# Altium schematic sheet EdgeMax_PowerSupply.SchDoc
size A3; SheetNumber: 2; SheetTotal: 3
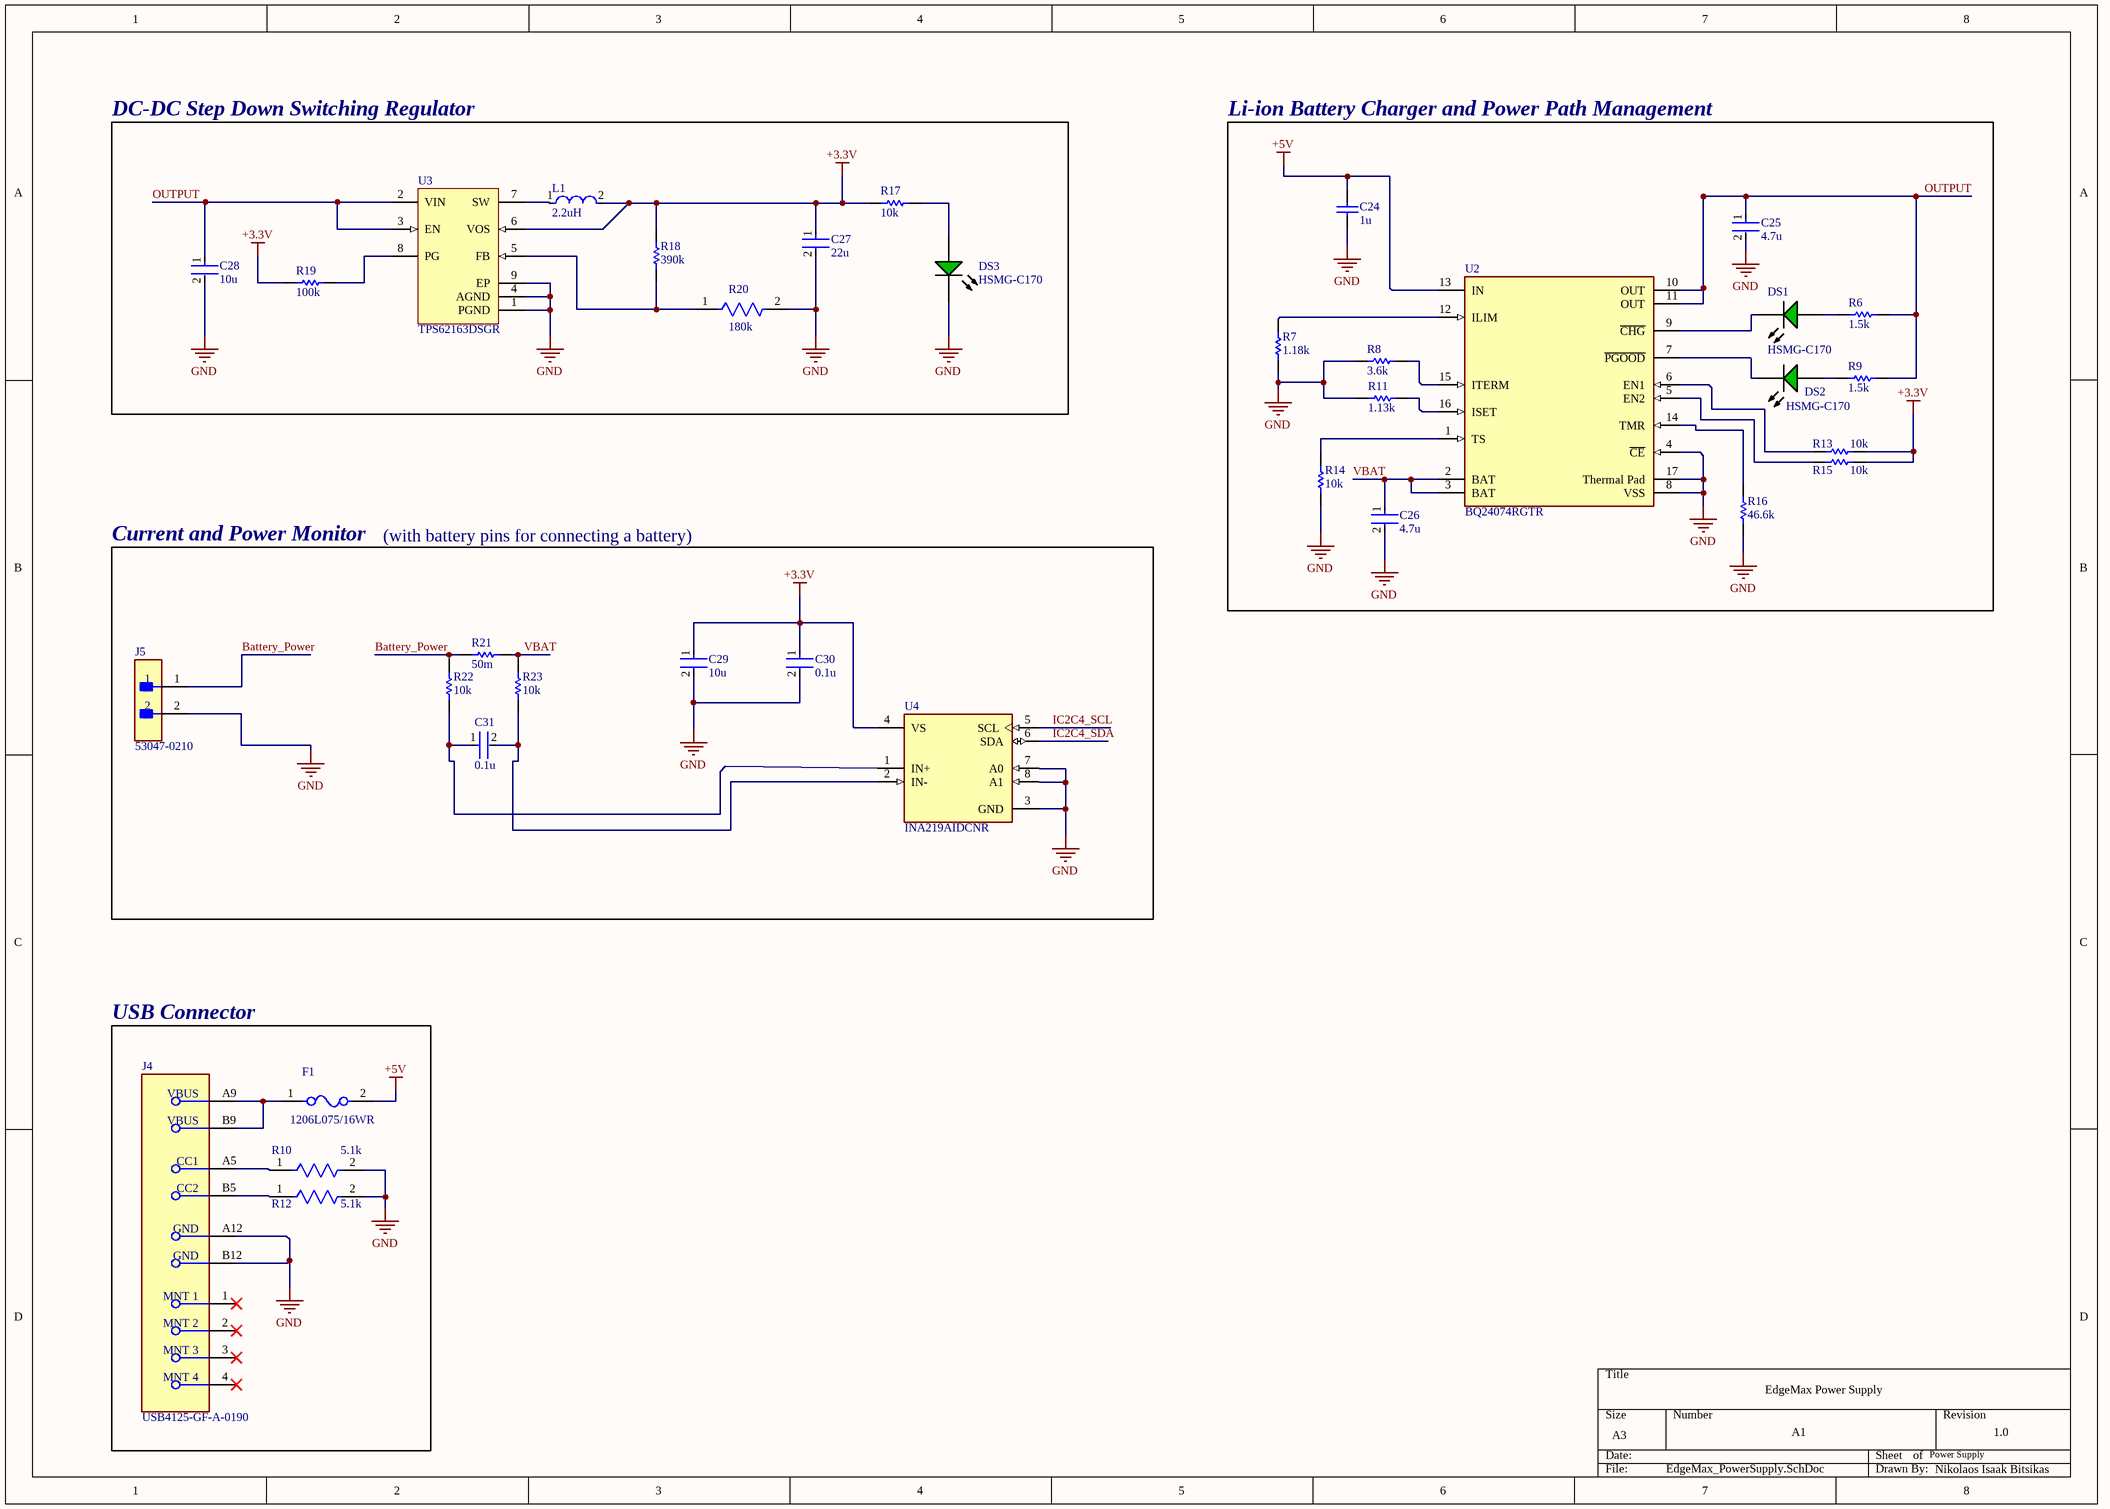
[diagram p0: EdgeMax_PowerSupply.SchDoc]

## Parts
C24  1u  [CAPC1608X90X35LL15T15]
C25  4.7u  [FP-CC1206-1_25-MFG]
C26  4.7u  [FP-CC1206-1_25-MFG]
C27  22u  [FP-C0805C226M9PACTU-MFG]
C28  10u  [FP-C0805C106K9PACTU-MFG]
C29  10u  [FP-GRM21B-0_1-MFG]
C30  0.1u  [FP-C0402-BB-MFG]
C31  0.1u  [FP-C0402-BB-MFG]
DS1  HSMG-C170  [AVAG-HSMX-C170_V]
DS2  HSMG-C170  [AVAG-HSMX-C170_V]
DS3  HSMG-C170  [AVAG-HSMX-C170_V]
F1  1206L075/16WR  [FP-1206L-MFG]
J4  USB4125-GF-A-0190  [FP-USB4125-GF-A-0190-MFG]
J5  53047-0210  [FP-53047-0210-MFG]
L1  2.2uH  [FP-CBMF1608-MFG]
R6  1.5k  [RESC1005X40X25LL10T10]
R7  1.18k  [RESC1609X50X30ML10T20]
R8  3.6k  [RESC1005X40X25ML05T05]
R9  1.5k  [RESC1005X40X25LL10T10]
R10  5.1k  [FP-CRCW0603-e3-IPC_C]
R11  1.13k  [RESC1005X40X25NL05T05]
R12  5.1k  [FP-CRCW0603-e3-IPC_C]
R13  10k  [RESC2013X60X35NL10T20]
R14  10k  [RESC2013X60X35NL10T20]
R15  10k  [RESC2013X60X35NL10T20]
R16  46.6k  [RESC1608X55X30LL15T15]
R17  10k  [RESC2013X60X35NL10T20]
R18  390k  [RESC0603X26X15NL03T05]
R19  100k  [RESC2013X50X30ML20T20]
R20  180k  [FP-CRCW0603-e3-IPC_A]
R21  50m  [RESC3225X70X50NL20T20]
R22  10k  [RESC2013X50X30NL20T20]
R23  10k  [RESC2013X50X30NL20T20]
U2  BQ24074RGTR  [FP-RGT0016C-IPC_B]
U3  TPS62163DSGR  [DSG0008A_V]
U4  INA219AIDCNR  [FP-DCN0008A-IPC_B]

## Blocks framed on the sheet
DC-DC Step Down Switching Regulator: C27 C28 DS3 L1 R17-R20 U3
Li-ion Battery Charger and Power Path Management: C24-C26 DS1 DS2 R6-R9 R11 R13-R16 U2
Current and Power Monitor: C29-C31 J5 R21-R23 U4
USB Connector: F1 J4 R10 R12

## Nets
+3.3V: C27.1 C29.1 C30.1 L1.2 R13.1 R15.1 R17.1 R18.2 R19.1 U3.6(VOS) U4.4(VS)
+5V: C24.2 F1.2 U2.13(IN)
GND: C24.1 C25.2 C26.2 C27.2 C28.2 C29.2 C30.2 DS3.2(K) J4.A12(GND) J4.B12(GND) J5.2 R7.1 R8.2 R10.2 R11.2 R12.2 R14.1 R16.1 R20.2 U2.4(~{CE}) U2.8(VSS) U2.17(Thermal_Pad) U3.1(PGND) U3.4(AGND) U3.9(EP) U4.3(GND) U4.7(A0) U4.8(A1)
Battery_Power: J5.1 R21.1 R22.2
IC2C4_SCL: U4.5(SCL)
IC2C4_SDA: U4.6(SDA)
OUTPUT: C25.1 C28.1 R6.2 R9.2 U2.10(OUT) U2.11(OUT) U3.2(VIN) U3.3(EN)
VBAT: C26.1 R21.2 R23.2 U2.2(BAT) U2.3(BAT)
NetC31_1: C31.1 R22.1 U4.1(IN+)
NetC31_2: C31.2 R23.1 U4.2(IN-)
NetDS1_1: DS1.1(A) R6.1
NetDS1_2: DS1.2(K) U2.9(~{CHG})
NetDS2_1: DS2.1(A) R9.1
NetDS2_2: DS2.2(K) U2.7(~{PGOOD})
NetDS3_1: DS3.1(A) R17.2
NetF1_1: F1.1 J4.A9(VBUS) J4.B9(VBUS)
NetJ4_A5: J4.A5(CC1) R10.1
NetJ4_B5: J4.B5(CC2) R12.1
NetL1_1: L1.1 U3.7(SW)
NetR7_2: R7.2 U2.12(ILIM)
NetR8_1: R8.1 U2.15(ITERM)
NetR11_1: R11.1 U2.16(ISET)
NetR13_2: R13.2 U2.6(EN1)
NetR14_2: R14.2 U2.1(TS)
NetR15_2: R15.2 U2.5(EN2)
NetR16_2: R16.2 U2.14(TMR)
NetR18_1: R18.1 R20.1 U3.5(FB)
NetR19_2: R19.2 U3.8(PG)

Not connected (* = marked no-connect by the designer): J4 1(MNT_1)* 2(MNT_2)* 3(MNT_3)* 4(MNT_4)*

## Notes on the sheet
- (with battery pins for connecting a battery)
- EdgeMax Power Supply
- A1
- Power Supply
- 1.0
- Nikolaos Isaak Bitsikas

## Library data of the parts
C24 = CMP-2006-02298-2: Manufacturer: Kemet; Part Number: C0603C105K4RACTU
C25 C26 = CMP-03422-000173-1: CAP CER 4.7UF 50V X7R 1206; Manufacturer Part Number: CC1206KKX7R9BB475; Manufacturer: Yageo; Automotive Grade: NA; Tolerance: 0.1; Temperature Coefficient: 15%; Material: Ceramic; Device Class L1: Passive Components; Category: Cap; Height: 1.45mm; Temperature Range Low: -55°C; Temperature Range High: +125°C; Package: CC1206-1.25; Lead Free: Yes; Temperature: -55°C to +125°C; RoHS: TRUE; Digikey Description: CAP CER 4.7UF 50V X7R 1206; Voltage Rating: 50 V; Device Class L2: Capacitors; Capacitance: 4.7 uF; Footprint Url: http://www.yageo.com/exep/pages/download/literatures/UPY-C_GEN_24.pdf; ComponentLink2URL: http://www.yageo.com/documents/recent/UPY-NP0X7R_HV_1KV-to-3KV_11.pdf; Temperature Characteristic: X7R; Mouser Description: CC Series 1206 4.7 uF 50 V ±10% Tolerance X7R Multilayer Ceramic Capacitor; ComponentLink2Description: Datasheet; Device Class L3: Ceramic Capacitors; Octopart: https://octopart.com/cc1206kkx7r9bb475-yageo-50417574; Value: 4.7 uF; Automotive: No
C27 = CMP-2007-01021-2: CAP CER 22UF 6.3V X5R 0805; Tolerance: 20%; Dielectric Material: Ceramic; Dissipation Factor: 5%; RoHS Compliant: Yes; Capacitance: 22uF; Packaging: Tape and Reel; Voltage: 6.3V; Package Quantity: 2500; Width: 1.2mm; Construction: Flat; Radiation Hardening: No; Lead Free: Lead Free; Voltage Rating (DC): 6.3V; Termination: SMD/SMT; Voltage Rating: 6.3V; Height: 1.25mm; Depth: 1.25mm; Max Operating Temperature: 85°C; Dielectric: X5R; Case/Package: 0805; Case Code (Imperial): 0805; Min Operating Temperature: -55°C; REACH SVHC: No SVHC; Mount: Surface Mount; Length: 2mm; Number of Pins: 2; Case Code (Metric): 2012
C28 = CMP-03020-034676-1: CAP CER 10UF 6.3V X5R 0805; Dielectric Material: Ceramic; Dissipation Factor: 5%; Tolerance: 10%; Capacitance: 10uF; Thickness: 0.055inch; Mount: Surface Mount; Voltage: 6.3V; Case Code (Imperial): 0805; Lead Pitch: 0.75mm; Height: 1.25mm; Construction: Flat; Number of Pins: 2; Contact Material: Tin; Case/Package: 0805; Case Code (Metric): 2012; Termination: SMD/SMT; Width: 1.2mm; Dielectric: X5R; Lead Free: Lead Free; Min Operating Temperature: -55°C; Voltage Rating (DC): 6.3V; Series: C; Packaging: Tape and Reel; Radiation Hardening: No; Length: 2mm; REACH SVHC: No SVHC; RoHS Compliant: Yes; Max Operating Temperature: 85°C; Package Quantity: 1; Voltage Rating: 6.3V; Depth: 1.25mm
C29 = CMP-2007-03534-2: Chip Multilayer Ceramic Capacitors for General Purpose, 0805, 10uF, X5R, 15%, 10%, 16V; Case Code (Imperial): 0805; Packaging: Tape and Reel; Width: 0.049inch; Depth: 1.25mm; Voltage Rating: 16V; Height: 1.25mm; Case/Package: 0805; Max Operating Temperature: 85°C; Min Operating Temperature: -55°C; Tolerance: 10%; Dielectric: X5R; REACH SVHC: No SVHC; Mount: Surface Mount; Radiation Hardening: No; Case Code (Metric): 2012; Length: 2mm; Package Quantity: 10000; Voltage Rating (DC): 16V; Voltage: 16V; Capacitance: 10uF; Thickness: 0.053inch; Termination: SMD/SMT
C30 = CMP-2008-02108-2: CAP CER 0.1UF 16V X7R 0402; Manufacturer: Kemet; Manufacturer Part Number: C0402C104K4RACTU; Value: 0.10 μF; Tolerance: 0.1; Material: Ceramic; Temperature Coefficient: 15%; Voltage Rating: 16 V; Package: C0402-BB; Automotive: No; Ipc Land Pattern Name: CAPC10050X50; Device Class L3: Ceramic Capacitors; Capacitance: 0.10 μF; Octopart: https://octopart.com/c0402c104k4ractu-kemet-94158; Temperature Characteristic: X7R; Mouser Description: Cap Ceramic 0.1uF 16V X7R 10% SMD 0402 125?C Paper T/R - Tape and Reel (Alt: C0402C104K4RAC TU); ComponentLink2Description: Datasheet; Temperature Range Low: -55°C; RoHS: TRUE; Device Class L1: Passive Components; Temperature Range High: +125°C; Device Class L2: Capacitors; ComponentLink2URL: https://content.kemet.com/datasheets/KEM_C1002_X7R_SMD.pdf; Category: Cap; Height: 0.55mm; Temperature: -55°C to +125°C; Lead Free: Yes; Digikey Description: CAP CER 0.1UF 16V X7R 0402
C31 = CMP-2008-02046-2: CAP CER 0.1UF 10V X5R 0402; Manufacturer: Kemet; Manufacturer Part Number: C0402C104K8PACTU; Material: Ceramic; Capacitance: 0.10 μF; Temperature Coefficient: 15%; Tolerance: 0.1; Value: 0.10 μF; Package: C0402-BB; Temperature: -55°C to +125°C; ComponentLink2Description: Datasheet; Temperature Characteristic: X5R; Device Class L1: Passive Components; Height: 0.55mm; Lead Free: Yes; ComponentLink2URL: https://content.kemet.com/datasheets/KEM_C1002_X7R_SMD.pdf; Device Class L2: Capacitors; Temperature Range Low: -55°C; Temperature Range High: +125°C; RoHS: TRUE; Octopart: https://octopart.com/c0402c104k8pactu-kemet-140039; Automotive: No; Mouser Description: Capacitor 100 nF 10 VDC 0402; Category: Cap; Voltage Rating: 10 V; Digikey Description: CAP CER 0.1UF 10V X5R 0402; Ipc Land Pattern Name: CAPC10050X50; Device Class L3: Ceramic Capacitors
DS1-DS3 = CMP-2000-05062-1: Chip LED, Green, 2.2 V, -40 to 85 degC, 2-Pin SMD, Pb-Free, Tape and Reel; Manufacturer: Avago; No. of Pins: 2; Peak Wavelength: 570nm; SVHC: NoSVHC(16-Jun-2014); Dominant Wavelength: 572nm; Forward Current If: 20mA; Viewing Angle: 170deg; Lens Shape: Rectangular; PIV Max: 5V; External Width: 1.25mm; LED Type: Standard; External Depth: 0.8mm; Opto Mounting Orientation: Top; Luminous Intensity: 15mcd; Luminous Intensity Min: 4mcd; Forward Voltage VF Max: 2.6V; External Length / Height: 2mm; Bulb Size: 1.25mmx1.4mm; Light Area Height: 1mm; Voltage Vf Typ: 2.2V; Operating Temperature Max: 85degC; Datasheet Version: Oct-08; MSL: MSL2A-4weeks; Peak Forward Current: 20mA; Package Description: 2-Pin Surface Mount Device, Body 2 x 1.25 mm, Height 0.8 mm; Datasheet URL: https://datasheet.ciiva.com/29280/180495-da-01-en-chip-led-hsmg-c170-gelb-gruen-29280971.pdf; Storage Temperature Min: -40degC; LED Colour: Green; Wavelength Typ: 570nm; Mounting Type: SMD; Forward Current If Max: 20mA; Dominant Wavelength Typ: 572nm; LED Mounting: SMD; Operating Temperature Range: -30degCto+85degC; Operating Temperature Min: -30degC; Manufacturer URL: http://www.avagotech.com/; Packaging: CutTape; Luminous Intensity Typ: 15mcd; Package Reference: HSMX-C170; Storage Temperature Max: 85degC; Opto Case Style: SMD; Forward Voltage: 2.2V
F1 = CMP-08606-000003-1: PTC RESET FUSE 16V 750MA 1206; Manufacturer: Littelfuse Inc; Hold Current: 0.75A; Resistance: 0.09-0.29Ω; Value: 0.09-0.29Ω; Trip Time: 0.2s; Current Rating: 100A; Trip Current: 1.5A; Device Class L2: PTC Resettable Fuses; RoHS: TRUE; Temperature: -40°C to +85°C; ComponentLink2URL: https://www.littelfuse.com/~/media/electronics/datasheets/resettable_ptcs/littelfuse_ptc_1206l_datasheet.pdf.pdf; Voltage Rating: 16V; Category: Fuse; Manufacturer Part Number: 1206L075/16WR; Lead Free: Yes; Digikey Description: PTC RESET FUSE 16V 750MA 1206; Temperature Range Low: -40°C; Temperature Range High: +85°C; Octopart: https://octopart.com/1206l075%2F16wr-littelfuse-28867102; Package: 1206L; Device Class L1: Circuit Protection; Height: 1.25mm; ComponentLink2Description: Datasheet; Automotive: No; Mouser Description: Resettable Fuses - PPTC 16V 0.75A 1206 PTC; Device Class L3: unset
J4 = CMP-245163-000004-1: CONN RCPT TYPE C 6P SMD RA
J5 = CMP-2000-05628-3: CONN HEADER VERT 2POS 1.25MM; Manufacturer: Molex; Conn Gender: Male; Voltage Rating: 125V; Conn Orientation: Vertical; Number Of Contacts: 2; Current Rating: 1A; Contact Material: Tin; Temperature Range Low: -40°C; ComponentLink2URL: http://www.molex.com/webdocs/datasheets/pdf/en-us/0530470210_PCB_HEADERS.pdf; Mouser Description: 1.25mm Pitch PicoBlade™ Wire-to-Board Header, Vertical, with Friction Lock, 2 Circuits; Manufacturer Part Number: 53047-0210; Temperature Range High: +85°C; ComponentLink2Description: Datasheet; Automotive: No; RoHS: TRUE; Ambient Temperature Range High: +85°C; Octopart: https://octopart.com/53047-0210-molex-276772; Footprint Url: https://www.molex.com/pdm_docs/sd/530470210_sd.pdf; Lead Free: Yes; Pitch: 1.25mm; Temperature: -40°C to +85°C; Device Class L2: Headers and Wire Housings; Package: 0; Ambient Temperature Range Low: -40°C; Digikey Description: CONN HEADER VERT 2POS 1.25MM; Category: Conn; Device Class L3: unset; Number Of Rows: 1; Device Class L1: Connectors; Height: 4.4mm
L1 = CMP-14484-000379-1: SMD Inductors 2.2uH ±20% 0.56A 0.221Ω 0603; Core Material: Ferrite; Shielding: Unshielded; DC Resistance (DCR): 221mR; Current Rating: 560mA; Test Frequency: 7.96MHz; Saturation Current: 190mA; Self Resonant Frequency: 80MHz; Packaging: Tape and Reel; Tolerance: 20%; Width: 0.8mm; Length: 1.6mm; Min Operating Temperature: -40°C; RoHS Compliant: Yes; Halogen Free: Halogen Free; Height: 0.8mm; Package Quantity: 1; Mount: Surface Mount; Depth: 1mm; Height - Seated (Max): 0.039inch; Case Code (Metric): 1608; Series: CBMF; Termination: SMD/SMT; Case Code (Imperial): 0603; Military Standard: Not; Max DC Current: 560mA; Case/Package: 0603; Resistor Type: Wirewound; Radiation Hardening: No; Lead Free: Lead Free; Inductance Tolerance: 20%; DC Current: 560mA; Max Operating Temperature: 105°C; Inductance: 2.2uH
R6 R9 = CMP-2002-05878-1: Manufacturer: Panasonic; Part Number: ERA2AEB152X
R7 = CMP-2000-02981-1: Part Number: CRCW06031K18FKEA; Manufacturer: Vishay Dale
R8 = CMP-2002-00892-1: Manufacturer: Panasonic; Part Number: ERJ-2RKF3601X
R10 R12 = CMP-1012-00590-3: RES Thick Film, 5.1kΩ, 1%, 0.1W, 100ppm/°C, 0603; Power Rating: 100mW; Voltage Rating (DC): 75V; Resistance: 5.1kR; Width: 0.85mm; Depth: 0.85mm; Military Standard: Not; Package Quantity: 5000; Case Code (Metric): 1608; Length: 1.55mm; Weight: 7.1E-05oz; Packaging: Tape and Reel; Temperature Coefficient: 100ppm/°C; Case Code (Imperial): 0603; Lead Free: Lead Free; Radiation Hardening: No; Contact Plating: Tin; Composition: Thick Film; Max Operating Temperature: 155°C; Termination: SMD/SMT; Case/Package: 0603; Min Operating Temperature: -55°C; Tolerance: 1%; Voltage Rating: 75V; Mount: Surface Mount; Height: 0.45mm
R11 = CMP-2002-00630-1: Manufacturer: Panasonic; Part Number: ERJ-2RKF1131X
R13-R15 R17 = CMP-1659-00013-4: Chip Resistor, 10 KOhm, +/- 1%, 0.125 W, -55 to 155 degC, 0805 (2012 Metric), RoHS, Tape and Reel; Manufacturer: Yageo; Voltage Rating: 150 V; Mount: Surface Mount; ComponentLink1Description: Manufacturer URL; ComponentLink2URL: http://www.yageo.com/documents/recent/PYu-RC_Group_51_RoHS_L_04.pdf; Pins: 2; Length: 2 mm; Min Operating Temperature: -55 degC; Height: 0.5 mm; Mounting Technology: Surface Mount; RoHSCompliant: true; REACH SVHC: No SVHC; ComponentLink1URL: http://www.yageo.com/; Max Operating Temperature: 155 degC; PackageReference: 0805; DatasheetVersion: Rev. 4, 02/2016; Package Quantity: 5000; Packaging: Tape and Reel; ComponentLink2Description: Datasheet; PackageDescription: 2-Pin Surface Mounted Device, Body 2 x 1.25 mm
R16 = CMP-2000-00518-1: Manufacturer: Panasonic; Part Number: ERJ-3EKF4642V
R18 = CMP-1010-00708-2: Manufacturer: Panasonic; Part Number: ERJ1GNF3903C
R19 = CMP-2001-04900-1: Manufacturer: Vishay Dale; Part Number: CRCW0805100KJNEA
R20 = CMP-2000-02950-2: RES Thick Film, 180kΩ, 1%, 0.1W, 100ppm/°C, 0603; Max Power Dissipation: 100mW; Resistance: 180kR; Voltage Rating: 75V; Military Standard: Not; Tolerance: 1%; Case/Package: 0603; Radiation Hardening: No; Temperature Coefficient: 100ppm/°C; Composition: Thick Film; Lead Free: Lead Free; Contact Plating: Tin; Height: 0.45mm; Number of Terminations: 2; Features: Automotive AEC-Q200; Package Quantity: 10; Width: 0.85mm; Weight: 7.1E-05oz; Termination: SMD/SMT; Depth: 0.85mm; Length: 1.55mm; Case Code (Metric): 1608; Case Code (Imperial): 0603; Voltage Rating (DC): 75V; Min Operating Temperature: -55°C; Max Operating Temperature: 155°C; Packaging: Tape and Reel; Power Rating: 100mW
R21 = CMP-2005-03841-2: Part Number: ERJ-L14KF50MU; Manufacturer: Panasonic
R22 R23 = CMP-2001-04915-1: Manufacturer: Vishay Dale; Part Number: CRCW080510R0FKEA
U2 = CMP-0321-00220-3: IC LI-ION CHARGE MGMT 16-QFN; Fault Protection: Over Voltage; Max Charge Current: 1.5A; Interface: USB; Max Supply Voltage: 10.2V; Number of Cells: 1; Battery Pack Voltage: 4.2V; Min Supply Voltage: 4.35V; Battery Chemistry: LITHIUM-ION; Min Input Voltage: 4.3V; Lead Free: Lead Free; Max Operating Temperature: 125°C; RoHS Compliant: Yes; Contact Plating: Gold; Min Operating Temperature: -40°C; Weight: 0.000808oz; Package Quantity: 3000; Radiation Hardening: No; Case/Package: VQFN; Output Voltage: 4.2V; Packaging: Tape and Reel; Series: -; Output Current: 1.5A; Number of Pins: 16
U3 = CMP-0323-00318-3: Buck Step Down Regulator with 3 to 17 V Input and 5 V Output, -40 to 85 degC, 8-Pin WSON (DSG), Green (RoHS & no Sb/Br); Manufacturer: Texas Instruments; Synchronous Rectification: TRUE; Vout(Max)(V): 5; Iq(Typ)(mA): 0.017; Rating: Catalog; Switch Current Limit(Typ)(A): 1.8; Iout(Max)(A): 1; Vin(Max)(V): 17; Duty Cycle(Max)(%): 100; Vin(Min)(V): 3; SubFamily: Step-Down Regulator; PartNumber: TPS62163DSGR; PackageDescription: 8-Pin Plastic Small Outline No-Lead, 2 x 2 x 0.8 mm Body, 0.5 mm Pitch, Exposed Pad; PackageReference: DSG0008A; ComponentLink2Description: Package Specification; PackageVersion: revB, Oct-2010; ComponentLink1URL: http://www.ti.com/general/docs/lit/getliterature.tsp?genericPartNumber=TPS62163&fileType=pdf; ComponentLink2URL: http://www.ti.com/litv/pdf/mpds308a; DatasheetVersion: SLVSAM2A; Mounting Technology: Surface Mount; Eco-Plan: Green (RoHS & no Sb/Br); Code_JEDEC: MO-229; ComponentLink3Description: URL Link1; Topology: Buck; Regulated Outputs(#): 1; Preset Vout(V): 5; Vout(Min)(V): 5; ComponentLink1Description: Datasheet; ComponentLink3URL: Samples URL:http://www.ti.com/product/tps62163#samples
U4 = CMP-0704-00041-3: IC CURRENT MONITOR 1% SOT23-8; Common Mode Rejection Ratio: 100dB; Bandwidth: 3.4MHz; Operating Supply Current: 1mA; Nominal Supply Current: 700uA; Min Input Voltage: 0V; Output Current per Channel: 10mA; Number of Amplifiers: 1; Input Offset Voltage (Vos): 100uV; Max Input Voltage: 26V; Min Supply Voltage: 3V; Max Supply Current: 5mA; Max Supply Voltage: 5.5V; Output Type: Digital; Accuracy: 1%; Radiation Hardening: No; Min Operating Temperature: -40°C; Contact Plating: Gold; REACH SVHC: No SVHC; Packaging: Tape and Reel; Max Operating Temperature: 125°C; Lead Free: Lead Free; Weight: 0.001411oz; Supply Current: 700uA; Number of Pins: 8; Length: 3mm; Quiescent Current: 700uA; Features: I²C; Height: 1.3mm; Output Current: 10mA; Case/Package: SOT-23-8; RoHS Compliant: Yes; Width: 1.75mm; Package Quantity: 3000; Series: Zero-Drift